# EAGLE schematic boardv2wiznet (EAGLE 6.6.0)
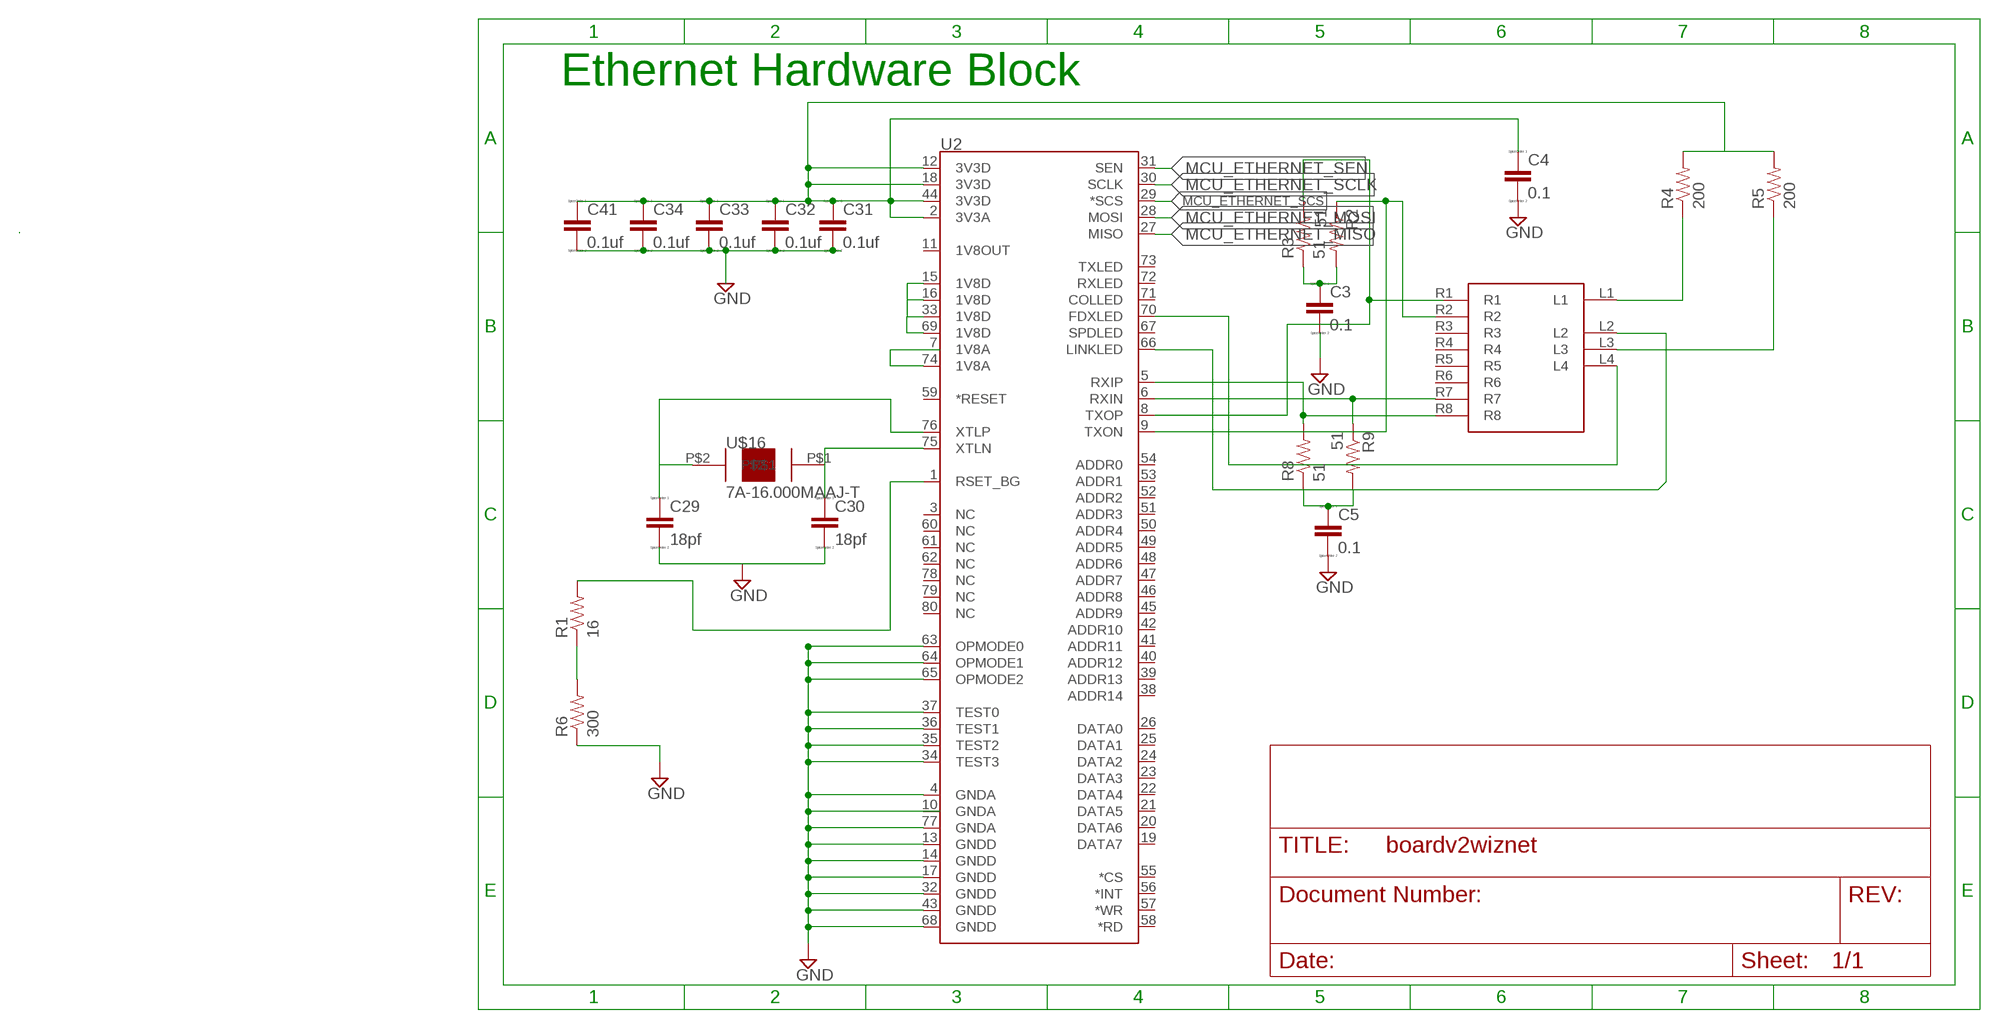
[diagram p0: schematic, sheet 1]

## Parts
C3  0.1  CC0603  [C0603]
C4  0.1  CC0603  [C0603]
C5  0.1  CC0603  [C0603]
C29  18pf  CC0603  [C0603]
C30  18pf  CC0603  [C0603]
C31  0.1uf  CC0603  [C0603]
C32  0.1uf  CC0603  [C0603]
C33  0.1uf  CC0603  [C0603]
C34  0.1uf  CC0603  [C0603]
C41  0.1uf  CC0603  [C0603]
R1  16  RESISTOR0603-RES  [0603-RES]
R2  51  RESISTOR0603-RES  [0603-RES]
R3  51  RESISTOR0603-RES  [0603-RES]
R4  200  RESISTOR0603-RES  [0603-RES]
R5  200  RESISTOR0603-RES  [0603-RES]
R6  300  RESISTOR0603-RES  [0603-RES]
R8  51  RESISTOR0603-RES  [0603-RES]
R9  51  RESISTOR0603-RES  [0603-RES]
U2  W5100  [LQFP-80]
U$1  ETHERNET_CONNECTOR  [RB1-125BAG1A]
U$16  7A-16.000MAAJ-T  [2-SMD]

## Nets
0.1: R3.2 U2.8(TXOP)
GND: C3.2 C4.2 C5.2 C29.2 C30.2 R6.1
MCU_ETHERNET_MISO: U2.27(MISO)
MCU_ETHERNET_MOSI: U2.28(MOSI)
MCU_ETHERNET_SCLK: U2.30(SCLK)
MCU_ETHERNET_SCS: U2.29(*SCS)
MCU_ETHERNET_SEN: U2.31(SEN)
N$1: C3.1 R2.2 R3.1
N$2: U2.66(LINKLED) U$1.L2
N$3: U2.74(1V8A)
N$4: C5.1 R8.1 R9.2
N$5: R2.1 U2.9(TXON) U$1.R2
N$6: R4.1 U$1.L1
N$7: R5.1 U$1.L3
N$8: U2.15(1V8D) U2.16(1V8D) U2.33(1V8D) U2.69(1V8D)
N$9: R9.1 U2.6(RXIN) U$1.R7
N$10: U2.70(FDXLED) U$1.L4
N$12: R8.2 U2.5(RXIP) U$1.R8
N$13: R1.1 R6.2
N$15: R1.2 U2.1(RSET_BG)
N$40: C31.2 C32.2 C33.2 C34.2 C41.2
N$45: C4.1 C31.1 C32.1 C33.1 C34.1 C41.1 R4.2 R5.2 U2.2(3V3A) U2.12(3V3D) U2.18(3V3D) U2.44(3V3D)
P$1_CLK_TO_XTLN_WIZNET: C30.1 U2.75(XTLN) U$16.P$1
P$2_CLK_TO_XTLP_WIZNET: C29.1 U2.76(XTLP) U$16.P$2
WIZNET_TO_GND: U2.4(GNDA) U2.13(GNDD) U2.14(GNDD) U2.17(GNDD) U2.32(GNDD) U2.34(TEST3) U2.35(TEST2) U2.36(TEST1) U2.37(TEST0) U2.43(GNDD) U2.63(OPMODE0) U2.64(OPMODE1) U2.65(OPMODE2) U2.68(GNDD) U2.77(GNDA) ; supply symbol labelled GND
Unconnected: U2.3(NC) U2.7(1V8A) U2.10(GNDA) U2.11(1V8OUT) U2.19(DATA7) U2.20(DATA6) U2.21(DATA5) U2.22(DATA4) U2.23(DATA3) U2.24(DATA2) U2.25(DATA1) U2.26(DATA0) U2.38(ADDR14) U2.39(ADDR13) U2.40(ADDR12) U2.41(ADDR11) U2.42(ADDR10) U2.45(ADDR9) U2.46(ADDR8) U2.47(ADDR7) U2.48(ADDR6) U2.49(ADDR5) U2.50(ADDR4) U2.51(ADDR3) U2.52(ADDR2) U2.53(ADDR1) U2.54(ADDR0) U2.55(*CS) U2.56(*INT) U2.57(*WR) U2.58(*RD) U2.59(*RESET) U2.60(NC) U2.61(NC) U2.62(NC) U2.67(SPDLED) U2.71(COLLED) U2.72(RXLED) U2.73(TXLED) U2.78(NC) U2.79(NC) U2.80(NC) U$1.R1 U$1.R3 U$1.R4 U$1.R5 U$1.R6

## Notes on the sheet
- Ethernet Hardware Block

## Library data of the parts
C3-C5 C29-C34 C41 = eagle-ltspice:C: CAPACITOR, European symbol; SPICEMODEL: NONE; SPICEPREFIX: C
R1-R6 R8 R9 = SparkFun-Passives:RESISTOR: Resistor Basic schematic elements and footprints for 0603, 1206, and PTH resistors.
U2 = SparkFun-DigitalIC:W5100: WIZnet W5100 TCP/IP PHY Embedded Chip See SparkFun catalog # COM-09471 Package: LQFP-80,10x10mm, 0.4mm pitch
U$1 = shit:ETHERNET_CONNECTOR
U$16 = version2:7A-16.000MAAJ-T

## Net classes
0 default: width 0.203 mm, drill 0.406 mm, clearance 0.102 mm
1 power: width 0.203 mm, drill 0.406 mm, clearance 0.203 mm
2 gnd: width 0.203 mm, drill 0.406 mm, clearance 0.203 mm
3 power usb: width 0.508 mm, drill 0.406 mm, clearance 0.203 mm